# EAGLE design ESPRO_2 (EAGLE 6.3)
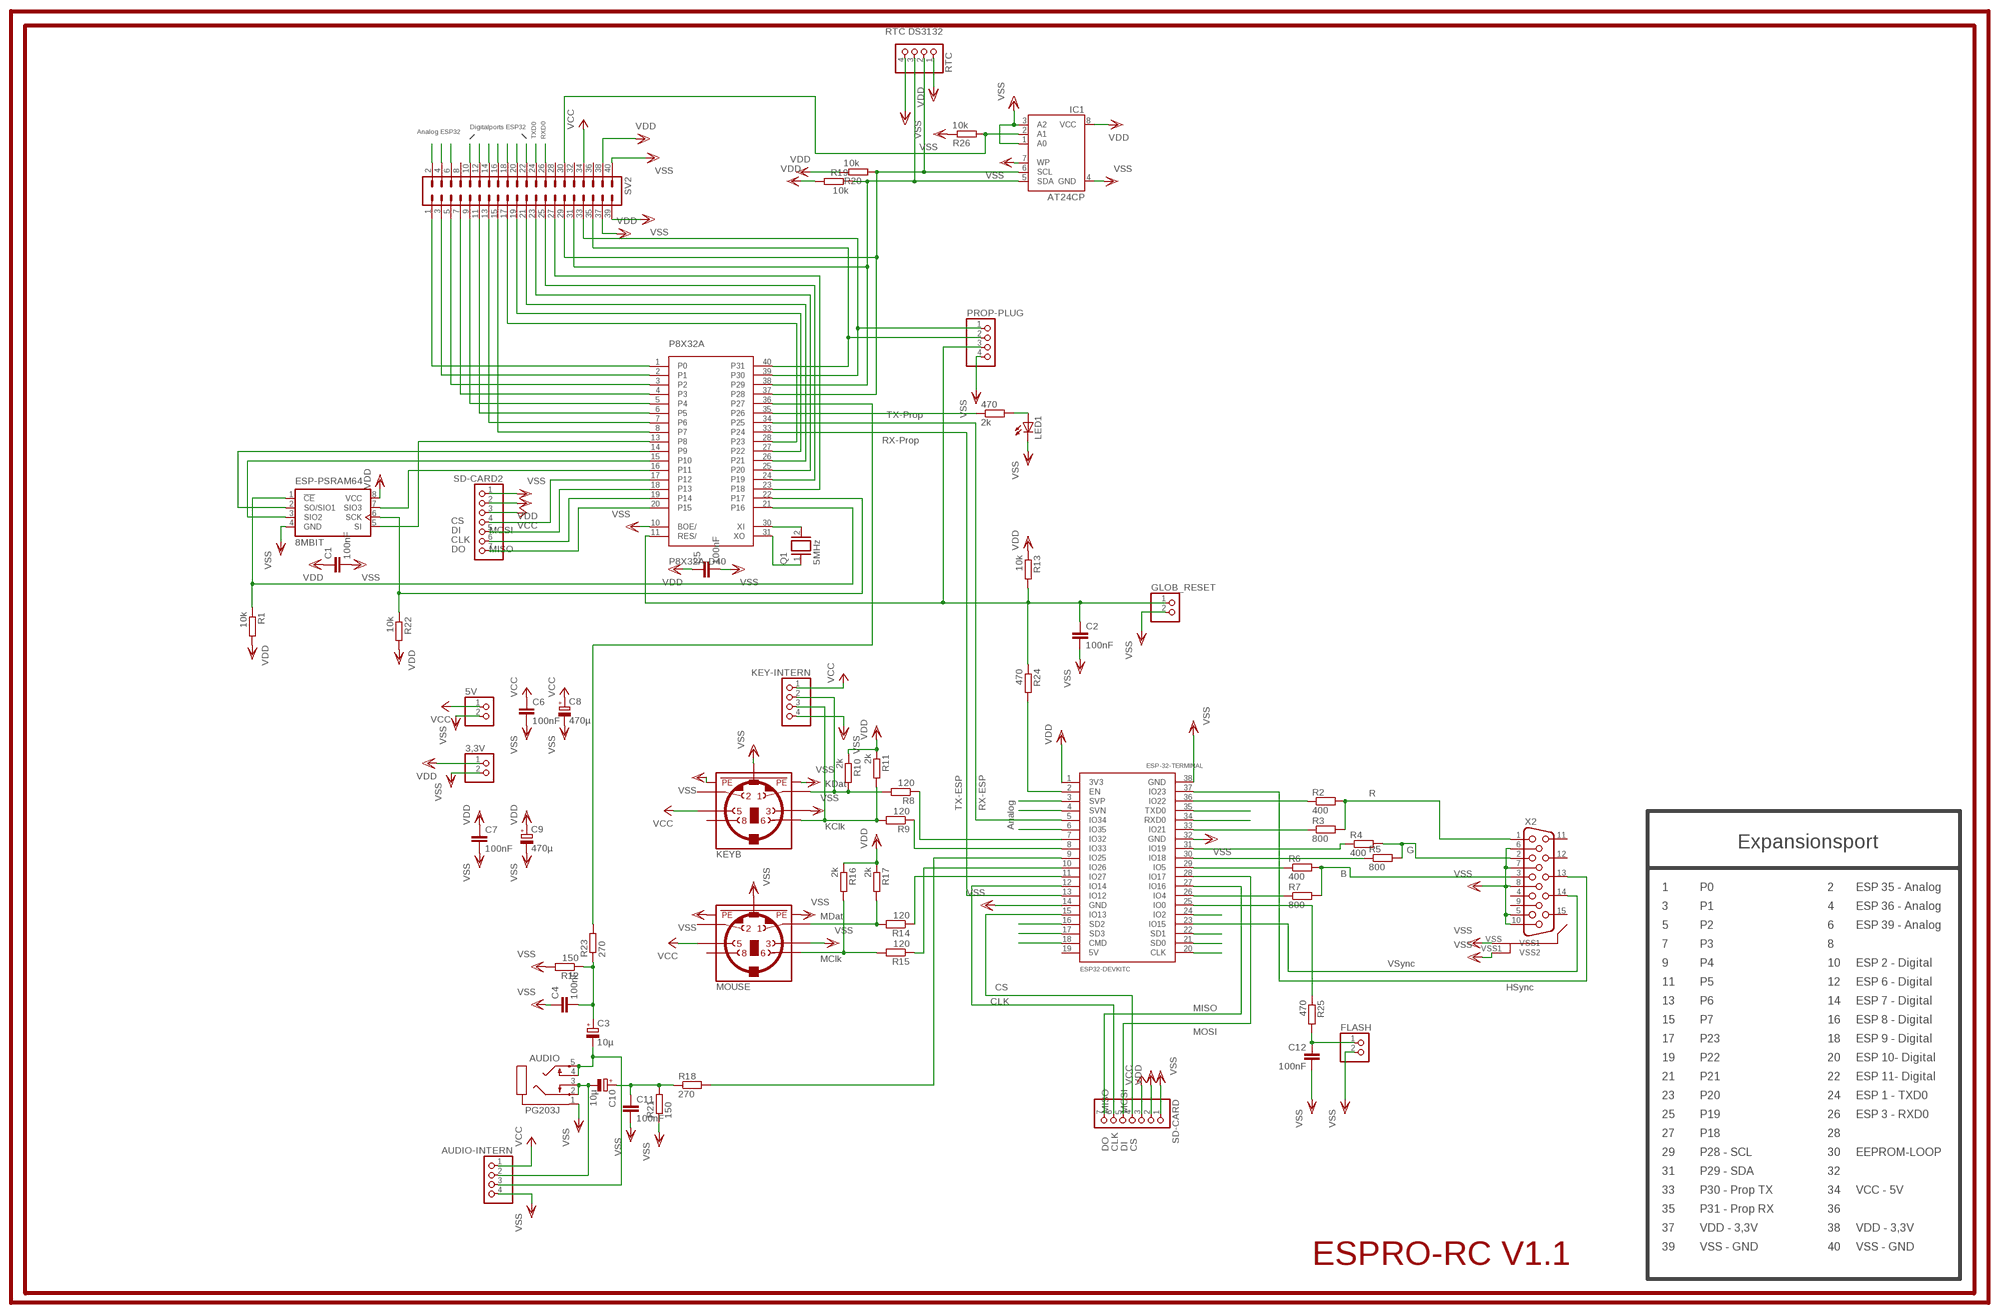
[diagram p0: schematic, sheet 1]

## Parts
3,3V  PINHD-1X2  [1X02]
5V  PINHD-1X2  [1X02]
470  2k  R-EU_0204/7  [0204/7]
AUDIO  PG203J  [PG203J]
AUDIO-INTERN  PINHD-1X4  [1X04]
C1  100nF  C-EU025-030X050  [C025-030X050]
C2  100nF  C-EU025-030X050  [C025-030X050]
C3  10µ  CPOL-EUE2-4  [E2-4]
C4  100nF  C-EU025-030X050  [C025-030X050]
C5  100nF  C-EU025-030X050  [C025-030X050]
C6  100nF  C-EU025-030X050  [C025-030X050]
C7  100nF  C-EU025-030X050  [C025-030X050]
C8  470µ  CPOL-EUE3.5-10  [E3,5-10]
C9  470µ  CPOL-EUE3.5-10  [E3,5-10]
C10  10µ  CPOL-EUE2-4  [E2-4]
C11  100nF  C-EU025-030X050  [C025-030X050]
C12  100nF  C-EU025-030X050  [C025-030X050]
ESP-32-TERMINAL  ESP32DEVKITC  [ESP32-DEVKITC]
ESP-PSRAM64  8MBIT  AT25P  [DIL08]
FLASH  PINHD-1X2  [1X02]
GLOB_RESET  PINHD-1X2  [1X02]
IC1  AT24CP  [DIL08]
KEY-INTERN  PINHD-1X4  [1X04]
KEYB  MINI_DIN_6  [M_DIN6]
LED1  LED5MM  [LED5MM]
MOUSE  MINI_DIN_6  [M_DIN6]
P8X32A  P8X32A-D40  [P8X32A-D40]
PROP-PLUG  PINHD-1X4  [1X04]
Q1  5MHz  XTAL/S  [QS]
R1  10k  R-EU_0204/7  [0204/7]
R2  400  R-EU_0204/7  [0204/7]
R3  800  R-EU_0204/7  [0204/7]
R4  400  R-EU_0204/7  [0204/7]
R5  800  R-EU_0204/7  [0204/7]
R6  400  R-EU_0204/7  [0204/7]
R7  800  R-EU_0204/7  [0204/7]
R8  120  R-EU_0204/7  [0204/7]
R9  120  R-EU_0204/7  [0204/7]
R10  2k  R-EU_0204/7  [0204/7]
R11  2k  R-EU_0204/7  [0204/7]
R12  150  R-EU_0204/7  [0204/7]
R13  10k  R-EU_0204/7  [0204/7]
R14  120  R-EU_0204/7  [0204/7]
R15  120  R-EU_0204/7  [0204/7]
R16  2k  R-EU_0204/7  [0204/7]
R17  2k  R-EU_0204/7  [0204/7]
R18  270  R-EU_0204/7  [0204/7]
R19  10k  R-EU_0204/7  [0204/7]
R20  10k  R-EU_0204/7  [0204/7]
R21  150  R-EU_0204/7  [0204/7]
R22  10k  R-EU_0204/7  [0204/7]
R23  270  R-EU_0204/7  [0204/7]
R24  470  R-EU_0204/7  [0204/7]
R25  470  R-EU_0204/7  [0204/7]
R26  10k  R-EU_0204/7  [0204/7]
RTC  PINHD-1X4  [1X04]
SD-CARD  PINHD-1X7  [1X07]
SD-CARD2  PINHD-1X7  [1X07]
SV2  ML40L  [ML40L]
X2  HF15H  [HDF15H]

## Nets
A35: ESP-32-TERMINAL.6(IO35) SV2.2
A36: ESP-32-TERMINAL.3(SVP) SV2.4
A39: ESP-32-TERMINAL.4(SVN) SV2.6
CLK: ESP-32-TERMINAL.12(IO14) SD-CARD.6
CS: ESP-32-TERMINAL.15(IO13) SD-CARD.4
E0: ESP-32-TERMINAL.25(IO0) R25.1
E2: ESP-32-TERMINAL.5(IO34) ESP-32-TERMINAL.24(IO2) P8X32A.34(P25) SV2.10
E6: ESP-32-TERMINAL.20(CLK) SV2.12
E7: ESP-32-TERMINAL.21(SD0) SV2.14
E8: ESP-32-TERMINAL.22(SD1) SV2.16
E9: ESP-32-TERMINAL.16(SD2) SV2.18
E10: ESP-32-TERMINAL.17(SD3) SV2.20
E11: ESP-32-TERMINAL.18(CMD) SV2.22
E12: ESP-32-TERMINAL.13(IO12) P8X32A.33(P24)
MISO: ESP-32-TERMINAL.27(IO16) SD-CARD.7
MOSI: ESP-32-TERMINAL.28(IO17) SD-CARD.5
N$1: ESP-PSRAM64.1(!CE!) P8X32A.21(P16) R1.1
N$2: ESP-PSRAM64.6(SCK) P8X32A.22(P17) R22.1
N$3: P8X32A.20(P15) SD-CARD2.7
N$4: P8X32A.19(P14) SD-CARD2.6
N$5: P8X32A.18(P13) SD-CARD2.5
N$6: P8X32A.17(P12) SD-CARD2.4
N$7: 470.1 P8X32A.35(P26)
N$8: ESP-32-TERMINAL.9(IO25) R18.2
N$9: ESP-PSRAM64.5(SI) P8X32A.13(P8)
N$10: ESP-PSRAM64.2(SO/SIO1) P8X32A.14(P9)
N$11: ESP-PSRAM64.3(SIO2) P8X32A.15(P10)
N$12: ESP-PSRAM64.7(SIO3) P8X32A.16(P11)
N$13: C10.+ C11.1 R18.1 R21.2
N$14: AUDIO-INTERN.2 AUDIO.2 AUDIO.3 C10.-
N$15: ESP-32-TERMINAL.2(EN) R24.2
N$16: C12.1 FLASH.1 R25.2
N$17: AUDIO-INTERN.3 AUDIO.4 AUDIO.5 C3.-
N$18: C3.+ C4.2 R12.1 R23.1
N$19: IC1.2(A1) R26.2 SV2.30
N$41: R6.2 R7.2 X2.3
N$42: R4.2 R5.2 X2.2
N$43: R2.2 R3.2 X2.1
N$44: ESP-32-TERMINAL.36(IO22) R2.1
N$45: ESP-32-TERMINAL.33(IO21) R3.1
N$46: ESP-32-TERMINAL.31(IO19) R4.1
N$47: ESP-32-TERMINAL.30(IO18) R5.1
N$48: ESP-32-TERMINAL.29(IO5) R6.1
N$49: ESP-32-TERMINAL.26(IO4) R7.1
N$50: ESP-32-TERMINAL.37(IO23) X2.13
N$51: ESP-32-TERMINAL.23(IO15) X2.14
N$60: 470.2 LED1.A
N$61: MOUSE.6 R15.2 R16.2
N$62: MOUSE.1 R14.2 R17.2
N$75: KEY-INTERN.2 KEYB.1 R8.2 R10.2
N$76: ESP-32-TERMINAL.7(IO32) R8.1
N$77: KEY-INTERN.3 KEYB.6 R9.2 R11.2
N$78: ESP-32-TERMINAL.8(IO33) R9.1
N$79: P8X32A.30(XI) Q1.2
N$82: ESP-32-TERMINAL.11(IO27) R14.1
N$83: ESP-32-TERMINAL.10(IO26) R15.1
N$93: P8X32A.31(XO) Q1.1
P0: P8X32A.1(P0) SV2.1
P1: P8X32A.2(P1) SV2.3
P2: P8X32A.3(P2) SV2.5
P3: P8X32A.4(P3) SV2.7
P4: P8X32A.5(P4) SV2.9
P5: P8X32A.6(P5) SV2.11
P6: P8X32A.7(P6) SV2.13
P7: P8X32A.8(P7) SV2.15
P18: P8X32A.23(P18) SV2.27
P19: P8X32A.24(P19) SV2.25
P20: P8X32A.25(P20) SV2.23
P21: P8X32A.26(P21) SV2.21
P22: P8X32A.27(P22) SV2.19
P23: P8X32A.28(P23) SV2.17
P27: P8X32A.36(P27) R23.2
P28: IC1.6(SCL) P8X32A.37(P28) R20.2 RTC.2 SV2.29
P29: IC1.5(SDA) P8X32A.38(P29) R19.1 RTC.3 SV2.31
P30: P8X32A.39(P30) PROP-PLUG.1 SV2.33
P31: P8X32A.40(P31) PROP-PLUG.2 SV2.35
RESET: C2.1 GLOB_RESET.1 P8X32A.11(RES/) PROP-PLUG.3 R13.2 R24.1
RXD0: ESP-32-TERMINAL.34(RXD0) SV2.26
TXD0: ESP-32-TERMINAL.35(TXD0) SV2.24
VCC [Power]: 5V.1 AUDIO-INTERN.1 C6.1 C8.+ KEY-INTERN.1 KEYB.5 MOUSE.5 SD-CARD2.3 SD-CARD.3 SV2.34
VDD [Power]: 3,3V.1 C1.1 C5.1 C7.1 C9.+ ESP-32-TERMINAL.1(3V3) ESP-PSRAM64.8(VCC) IC1.8(VCC) R1.2 R10.1 R11.1 R13.1 R16.1 R17.1 R19.2 R20.1 R22.2 RTC.1 SD-CARD2.2 SD-CARD.2 SV2.37 SV2.38
VSS [Power]: 3,3V.2 5V.2 AUDIO-INTERN.4 AUDIO.1 C1.2 C2.2 C4.1 C5.2 C6.2 C7.2 C8.- C9.- C11.2 C12.2 ESP-32-TERMINAL.14(GND) ESP-32-TERMINAL.32(GND) ESP-32-TERMINAL.38(GND) ESP-PSRAM64.4(GND) FLASH.2 GLOB_RESET.2 IC1.1(A0) IC1.3(A2) IC1.4(GND) IC1.7(WP) KEY-INTERN.4 KEYB.3 KEYB.SH1(PE1) KEYB.SH2(PE2) KEYB.SH3(PE3) LED1.K(C) MOUSE.3 MOUSE.SH1(PE1) MOUSE.SH2(PE2) MOUSE.SH3(PE3) P8X32A.10(BOE/) PROP-PLUG.4 R12.2 R21.1 R26.1 RTC.4 SD-CARD2.1 SD-CARD.1 SV2.39 SV2.40 X2.5 X2.6 X2.7 X2.8 X2.10 X2.VSS1(VSS2) X2.VSS(VSS1)
Unconnected: ESP-32-TERMINAL.19(5V) KEYB.2 KEYB.8 MOUSE.2 MOUSE.8 SV2.8 SV2.28 SV2.32 SV2.36 X2.4 X2.9 X2.11 X2.12 X2.15

## Notes on the sheet
- RTC DS3132
- Analog ESP32 | Digitalports ESP32
- TXD0 | RXD0
- TX-Prop
- RX-Prop
- CS
- DI | MOSI
- CLK
- DO | MISO
- KDat
- R
- TX-ESP | RX-ESP
- KClk | Analog
- Expansionsport
- G
- B
- 1 | P0 | 2 | ESP 35 - Analog
- 3 | P1 | 4 | ESP 36 - Analog
- MDat
- 5 | P2 | 6 | ESP 39 - Analog
- 7 | P3 | 8
- MClk
- VSync | 9 | P4 | 10 | ESP 2 - Digital
- 11 | P5 | 12 | ESP 6 - Digital
- CS | HSync
- CLK | MISO | 13 | P6 | 14 | ESP 7 - Digital
- 15 | P7 | 16 | ESP 8 - Digital
- MOSI
- 17 | P23 | 18 | ESP 9 - Digital
- 19 | P22 | 20 | ESP 10- Digital
- 21 | P21 | 22 | ESP 11- Digital
- 23 | P20 | 24 | ESP 1 - TXD0
- MISO | MOSI
- 25 | P19 | 26 | ESP 3 - RXD0
- 27 | P18 | 28
- DO | CLK | DI | CS
- 29 | P28 - SCL | 30 | EEPROM-LOOP
- 31 | P29 - SDA | 32
- 33 | P30 - Prop TX | 34 | VCC - 5V
- 35 | P31 - Prop RX | 36
- 37 | VDD - 3,3V | 38 | VDD - 3,3V
- 39 | VSS - GND | 40 | VSS - GND
- ESPRO-RC V1.1

## Power pins joined to a net without a drawn wire
GND: P8X32A.9(GND) P8X32A.29(GND)
VDD: P8X32A.12(VDD) P8X32A.32(VDD)

## Library data of the parts
3,3V 5V FLASH GLOB_RESET = pinhead:PINHD-1X2: PIN HEADER
470 R1-R26 = rcl:R-EU_: RESISTOR, European symbol
AUDIO = con-hirschmann:PG203J: MIC/HEADPHONE JACK KS-S stereo microphone/headphone jack PG203JN (Schukat); OC_FARNELL: unknown; OC_NEWARK: unknown
AUDIO-INTERN KEY-INTERN PROP-PLUG RTC = pinhead:PINHD-1X4: PIN HEADER
C1 C2 C4-C7 C11 C12 = rcl:C-EU: CAPACITOR, European symbol
C3 C8-C10 = rcl:CPOL-EU: POLARIZED CAPACITOR, European symbol
ESP-32-TERMINAL = ESP32-DEVKITC:ESP32DEVKITC
ESP-PSRAM64 = ESP-PSRAM:AT25*: EEPROM SPI bus serial
IC1 = atmel:AT24C*: 2-wire serial EEPROM; MPN: AT24C1024BW-SH-B; OC_FARNELL: 1362646; OC_NEWARK: 03P2044
KEYB MOUSE = mini_din:MINI_DIN_6
LED1 = led:LED: LED OSRAM: - CHIPLED LG R971, LG N971, LY N971, LG Q971, LY Q971, LO R971, LY R971 LH N974, LH R974 LS Q976, LO Q976, LY Q976 LO Q996 - Hyper CHIPLED LW Q18S LB Q993, LB Q99A, LB R99A - SideLED LS A670, LO A670, LY A670, LG A670, LP A670 LB A673, LV A673, LT A673, LW A673 LH A674 LY A675 LS A676, LA A676, LO A676, LY A676, LW A676 LS A679, LY A679, LG A679 - Hyper Micro SIDELED® LS Y876, LA Y876, LO Y876, LY Y876 LT Y87S - SmartLED LW L88C, LW L88S LB L89C, LB L89S, LG L890 LS L89K, LO L89K, LY L89K LS L896, LA L896, LO L896, LY L896 - TOPLED LS T670, LO T670, LY T670, LG T670, LP T670 LSG T670, LSP T670, LSY T670, LOP T670, LYG T670 LG T671, LOG T671, LSG T671 LB T673, LV T673, LT T673, LW T673 LH T674 LS T676, LA T676, LO T676, LY T676, LB T676, LH T676, LSB T676, LW T676 LB T67C, LV T67C, LT T67C, LS T67K, LO T67K, LY T67K, LW E67C LS E67B, LA E67B, LO E67B, LY E67B, LB E67C, LV E67C, LT E67C LW T67C LS T679, LY T679, LG T679 LS T770, LO T770, LY T770, LG T770, LP T770 LB T773, LV T773, LT T773, LW T773 LH T774 LS E675, LA E675, LY E675, LS T675 LS T776, LA T776, LO T776, LY T776, LB T776 LHGB T686 LT T68C, LB T68C - Hyper Mini TOPLED® LB M676 - Mini TOPLED Santana® LG M470 LS M47K, LO M47K, LY M47K Source: http://www.osram.convergy.de LUXEON: - LUMILED® LXK2-PW12-R00, LXK2-PW12-S00, LXK2-PW14-U00, LXK2-PW14-V00 LXK2-PM12-R00, LXK2-PM12-S00, LXK2-PM14-U00 LXK2-PE12-Q00, LXK2-PE12-R00, LXK2-PE12-S00, LXK2-PE14-T00, LXK2-PE14-U00 LXK2-PB12-K00, LXK2-PB12-L00, LXK2-PB12-M00, LXK2-PB14-N00, LXK2-PB14-P00, LXK2-PB14-Q00 LXK2-PR12-L00, LXK2-PR12-M00, LXK2-PR14-Q00, LXK2-PR14-R00 LXK2-PD12-Q00, LXK2-PD12-R00, LXK2-PD12-S00 LXK2-PH12-R00, LXK2-PH12-S00 LXK2-PL12-P00, LXK2-PL12-Q00, LXK2-PL12-R00 Source: www.luxeon.com KINGBRIGHT: KA-3528ASYC Source: www.kingbright.com
P8X32A = parallax_propeller:P8X32A-D40
Q1 = special:XTAL/S: CRYSTAL
SD-CARD SD-CARD2 = pinhead:PINHD-1X7: PIN HEADER
SV2 = con-ml:ML40L: HARTING; OC_FARNELL: unknown; OC_NEWARK: unknown
X2 = con-subd:HF15: SUB-D; OC_FARNELL: unknown; OC_NEWARK: unknown

## Net classes
0 default: width 0.254 mm, clearance 0.254 mm
1 Power: width 0.635 mm, drill 0.61 mm, clearance 0.381 mm

## Board
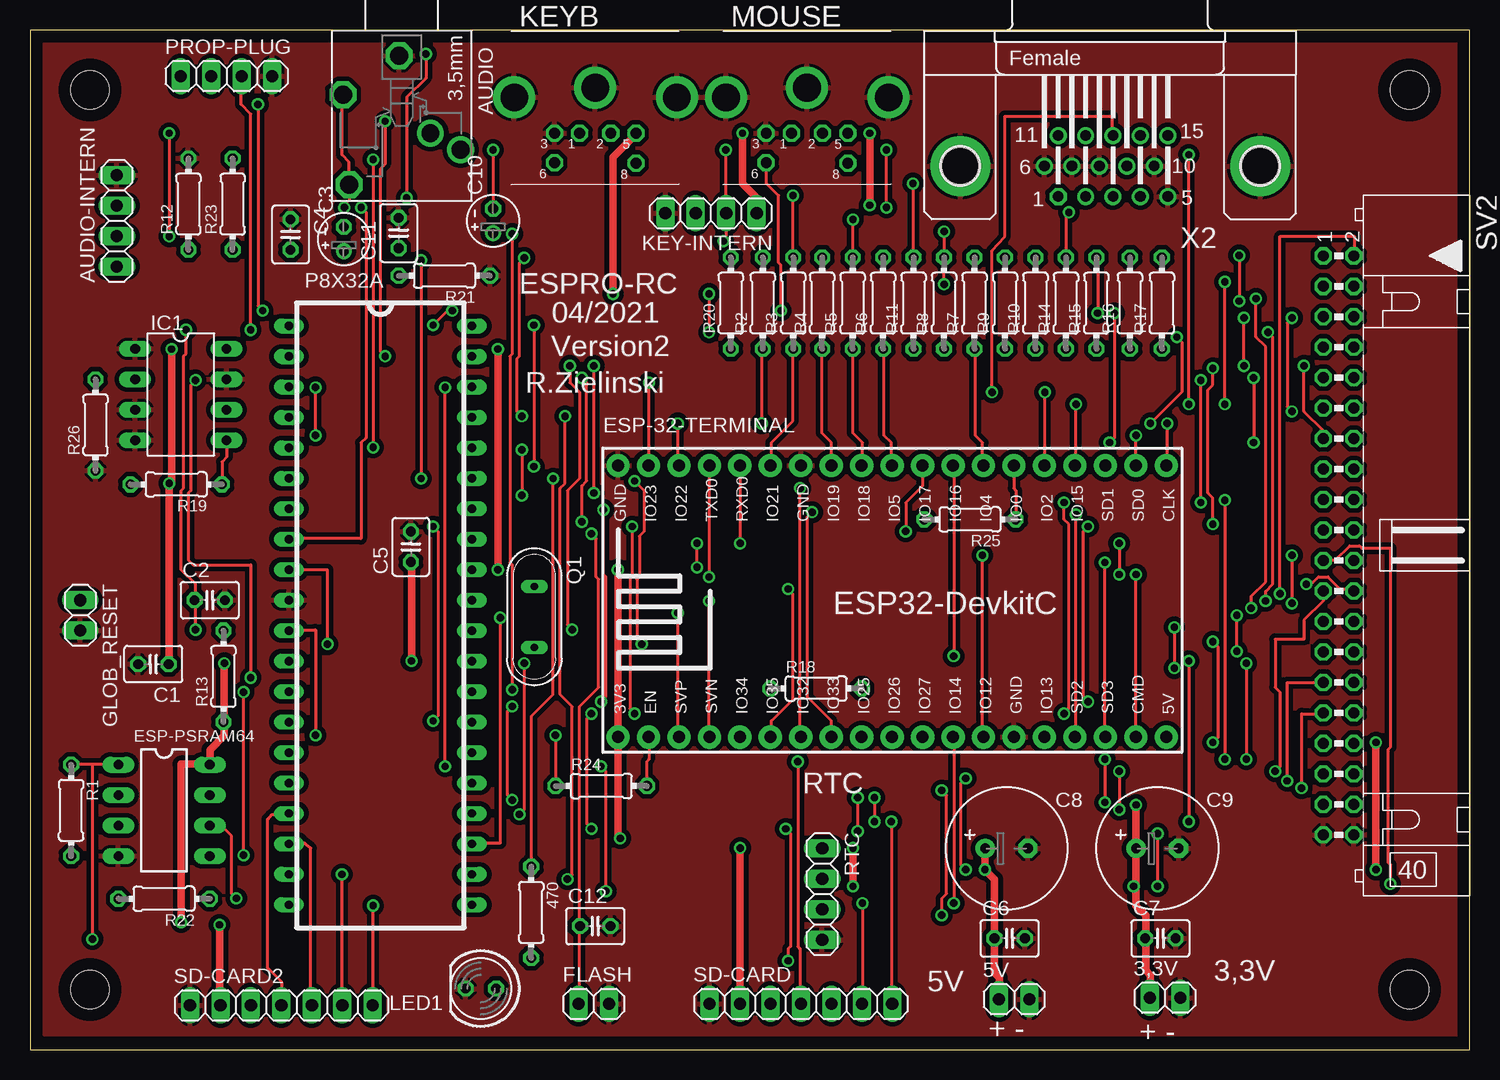
[diagram p1: board, top side]
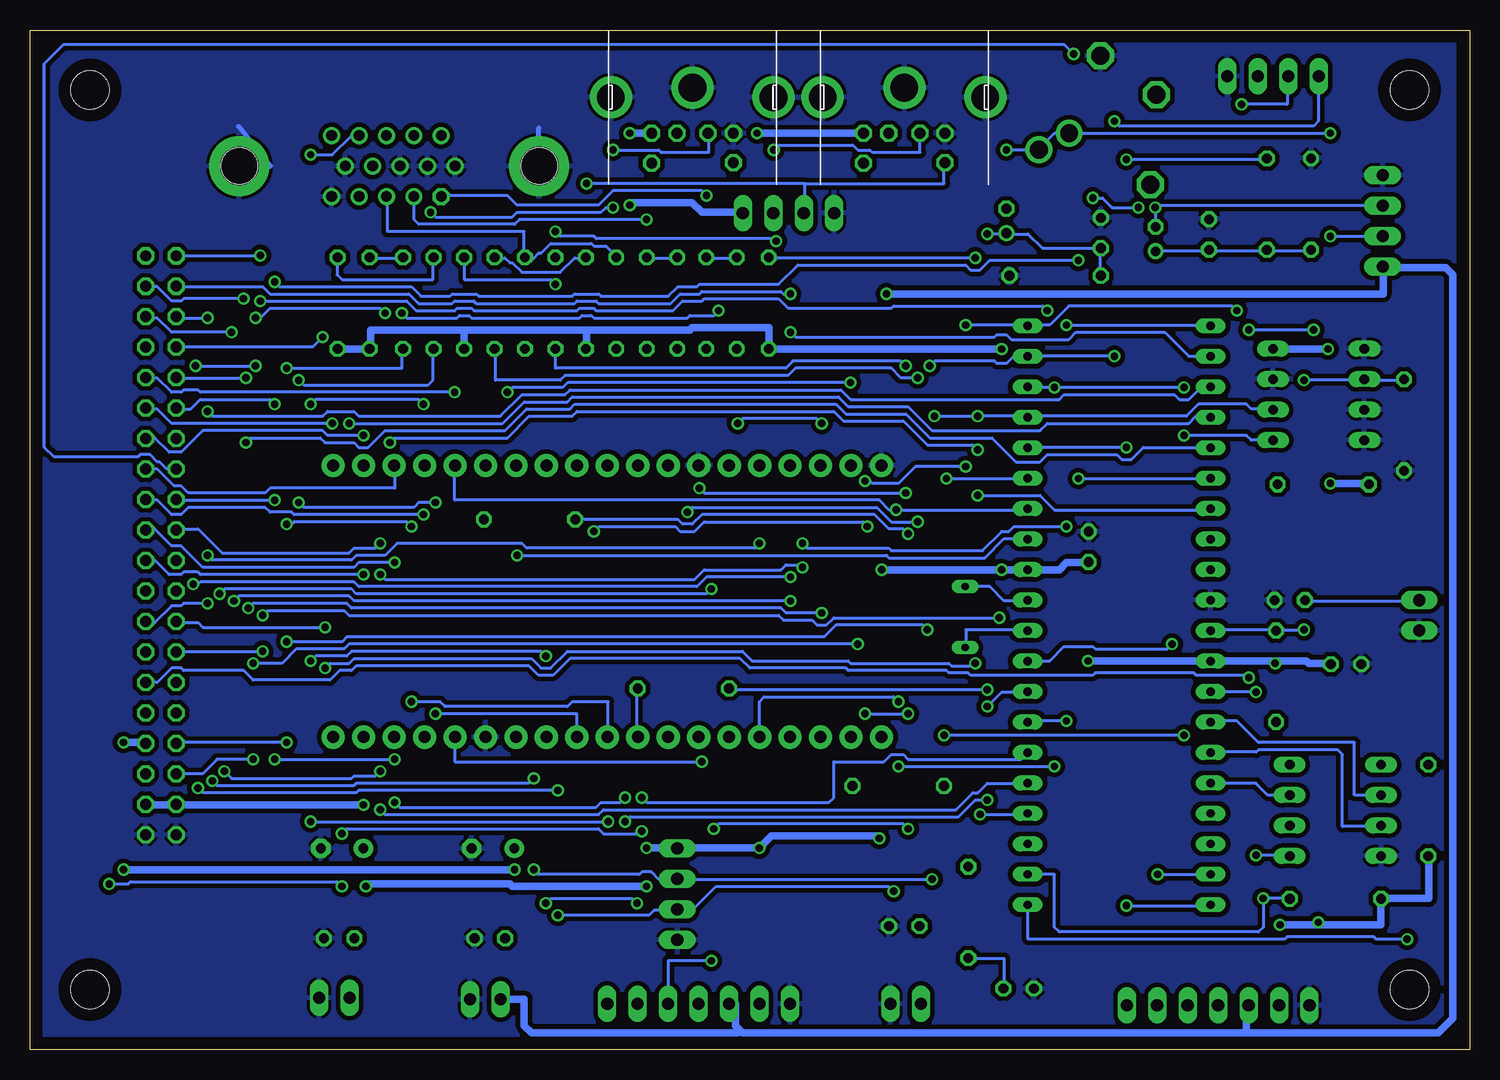
[diagram p2: board, bottom side, seen from below]

Size 120 x 85 mm. Coordinates in mm from the lower left corner, seen from the top.
Outline: 0,0 120,0 120,85 0,85 0,0
Copper layers (1*16): Top 0.035mm / dielectric 1.5mm / Bottom 0.035mm
Design rules "default": minimum track width 10mil, minimum drill 24mil, track to track 8mil, track to pad 8mil, pad to pad 8mil, via to via 8mil, smd to smd 8mil, copper to edge 40mil, drill to drill 8mil, minimum pad ring 10mil, minimum via ring 8mil, stop-mask expansion 4mil, vias tented up to drill 0mil, thermal gap 10mil
Holes 3.2 mm at 5,80 115,80 115,5 5,5

### Footprints (pad centres in the part's own frame; a part is rotated, then mirrored left to right if it is on the bottom)
1X02 = drill 1.016 long: 1 -1.27,0; 2 1.27,0
0204/7 = drill 0.813 octagon: 1 -3.81,0; 2 3.81,0
PG203J = drill 1.499 octagon: 1 -5.004,-0.203; 4 5.74,-4.369; 5 -1.753,-4.902 | drill 1.499: 2 2.845,4.902; 3 1.448,2.388
1X04 = drill 1.016 long: 1 -3.81,0; 2 -1.27,0; 3 1.27,0; 4 3.81,0
C025-030X050 = drill 0.813 octagon: 1 -1.27,0; 2 1.27,0
E2-4 = drill 0.813 pad 1.27: + -1.016,0 | drill 0.813 pad 1.27 octagon: - 1.016,0
E3,5-10 = drill 0.813 pad 1.6: + -1.778,0 | drill 0.813 pad 1.6 octagon: - 1.778,0
ESP32-DEVKITC = drill 1 pad 1.93: 1 -22.87,-11.42; 2 -20.33,-11.42; 3 -17.79,-11.42; 4 -15.25,-11.42; 5 -12.71,-11.42; 6 -10.17,-11.42; 7 -7.63,-11.42; 8 -5.09,-11.42; 9 -2.55,-11.42; 10 -0.01,-11.42; 11 2.53,-11.42; 12 5.07,-11.42; 13 7.61,-11.42; 14 10.15,-11.42; 15 12.69,-11.42; 16 15.23,-11.42; 17 17.77,-11.42; 18 20.31,-11.42; 19 22.85,-11.42; 20 22.85,11.23; 21 20.31,11.23; 22 17.77,11.23; 23 15.23,11.23; 24 12.69,11.23; 25 10.15,11.23; 26 7.61,11.23; 27 5.07,11.23; 28 2.53,11.23; 29 -0.01,11.23; 30 -2.55,11.23; 31 -5.09,11.23; 32 -7.63,11.23; 33 -10.17,11.23; 34 -12.71,11.23; 35 -15.25,11.23; 36 -17.79,11.23; 37 -20.33,11.23; 38 -22.87,11.23
DIL08 = drill 0.813 long: 1 -3.81,-3.81; 2 -1.27,-3.81; 3 1.27,-3.81; 4 3.81,-3.81; 5 3.81,3.81; 6 1.27,3.81; 7 -1.27,3.81; 8 -3.81,3.81
M_DIN6 = drill 0.9 pad 1.422 octagon: 1 -1.3,-3.75; 2 1.3,-3.75; 3 -3.4,-3.75; 5 3.4,-3.75; 6 -3.4,-6.2; 8 3.4,-6.25 | drill 2.3 pad 3.5: SH1 6.8,-0.75; SH2 0,0.05; SH3 -6.75,-0.75
LED5MM = drill 0.813 octagon: A -1.27,0; K 1.27,0
P8X32A-D40 = drill 0.7 pad 1.27 long: 1 -7.62,23.495; 2 -7.62,20.955; 3 -7.62,18.415; 4 -7.62,15.875; 5 -7.62,13.335; 6 -7.62,10.795; 7 -7.62,8.255; 8 -7.62,5.715; 9 -7.62,3.175; 10 -7.62,0.635; 11 -7.62,-1.905; 12 -7.62,-4.445; 13 -7.62,-6.985; 14 -7.62,-9.525; 15 -7.62,-12.065; 16 -7.62,-14.605; 17 -7.62,-17.145; 18 -7.62,-19.685; 19 -7.62,-22.225; 20 -7.62,-24.765; 21 7.62,-24.765; 22 7.62,-22.225; 23 7.62,-19.685; 24 7.62,-17.145; 25 7.62,-14.605; 26 7.62,-12.065; 27 7.62,-9.525; 28 7.62,-6.985; 29 7.62,-4.445; 30 7.62,-1.905; 31 7.62,0.635; 32 7.62,3.175; 33 7.62,5.715; 34 7.62,8.255; 35 7.62,10.795; 36 7.62,13.335; 37 7.62,15.875; 38 7.62,18.415; 39 7.62,20.955; 40 7.62,23.495
QS = drill 0.61 long: 1 -2.54,0; 2 2.54,0
1X07 = drill 1.016 long: 1 -7.62,0; 2 -5.08,0; 3 -2.54,0; 4 0,0; 5 2.54,0; 6 5.08,0; 7 7.62,0
ML40L = drill 0.914 octagon: 1 -24.13,-1.27; 2 -24.13,1.27; 3 -21.59,-1.27; 4 -21.59,1.27; 5 -19.05,-1.27; 6 -19.05,1.27; 7 -16.51,-1.27; 8 -16.51,1.27; 9 -13.97,-1.27; 10 -13.97,1.27; 11 -11.43,-1.27; 12 -11.43,1.27; 13 -8.89,-1.27; 14 -8.89,1.27; 15 -6.35,-1.27; 16 -6.35,1.27; 17 -3.81,-1.27; 18 -3.81,1.27; 19 -1.27,-1.27; 20 -1.27,1.27; 21 1.27,-1.27; 22 1.27,1.27; 23 3.81,-1.27; 24 3.81,1.27; 25 6.35,-1.27; 26 6.35,1.27; 27 8.89,-1.27; 28 8.89,1.27; 29 11.43,-1.27; 30 11.43,1.27; 31 13.97,-1.27; 32 13.97,1.27; 33 16.51,-1.27; 34 16.51,1.27; 35 19.05,-1.27; 36 19.05,1.27; 37 21.59,-1.27; 38 21.59,1.27; 39 24.13,-1.27; 40 24.13,1.27
HDF15H = drill 0.9 octagon: 1 4.329,2.54 | drill 0.9: 2 2.043,2.54; 3 -0.243,2.54; 4 -2.529,2.54; 5 -4.815,2.54; 6 5.472,0; 7 3.186,0; 8 0.9,0; 9 -1.386,0; 10 -3.672,0; 11 4.329,-2.54; 12 2.043,-2.54; 13 -0.243,-2.54; 14 -2.529,-2.54; 15 -4.815,-2.54 | drill 3.2 pad 5: VSS -12.5,0; VSS1 12.5,0 | hole 3: -12.5,0; 12.5,0

### Placement (x,y rotation side)
3,3V  94.61,4.32 0 top
5V  82.04,4.19 0 top
470  41.78,11.43 270 top
AUDIO  30.99,77.85 270 top
AUDIO-INTERN  7.24,69.09 90 top
C1  10.29,32.13 180 top
C2  14.99,37.47 0 top
C3  26.16,67.56 90 top
C4  21.72,67.94 270 top
C5  31.75,41.91 90 top
C6  81.66,9.27 0 top
C7  94.23,9.27 0 top
C8  81.41,16.76 0 top
C9  93.98,16.76 0 top
C10  38.61,69.09 90 top
C11  30.73,68.07 90 top
C12  47.12,10.29 0 top
ESP-32-TERMINAL  71.88,37.47 0 top
ESP-PSRAM64  11.18,19.94 270 top
FLASH  46.99,3.81 0 top
GLOB_RESET  4.19,36.2 270 top
IC1  12.57,54.61 270 top
KEY-INTERN  56.77,69.72 180 top
KEYB  47.12,80.14 0 top
LED1  37.59,5.08 180 top
MOUSE  64.77,80.14 0 top
P8X32A  29.21,36.83 0 top
PROP-PLUG  16.38,81.15 0 top
Q1  42.04,36.07 270 top
R1  3.43,19.94 270 top
R2  61.09,62.23 90 top
R3  63.63,62.23 90 top
R4  66.04,62.23 90 top
R5  68.58,62.23 90 top
R6  71.12,62.23 90 top
R7  78.74,62.23 90 top
R8  76.2,62.23 90 top
R9  81.28,62.23 90 top
R10  83.82,62.23 90 top
R11  73.66,62.23 90 top
R12  13.21,70.48 90 top
R13  16.13,31.11 90 top
R14  86.36,62.23 90 top
R15  88.9,62.23 90 top
R16  91.69,62.23 90 top
R17  94.36,62.23 90 top
R18  65.53,30.1 0 top
R19  12.19,47.12 180 top
R20  58.42,62.23 90 top
R21  34.54,64.52 180 top
R22  11.18,12.57 180 top
R23  16.89,70.48 90 top
R24  47.62,21.97 0 top
R25  78.36,44.2 180 top
R26  5.46,52.07 90 top
RTC  66.04,12.95 270 top
SD-CARD  64.26,3.81 0 top
SD-CARD2  20.95,3.68 0 top
SV2  109.09,42.04 270 top
X2  90.04,73.66 180 top

### Tracks (layer width: path | path; a pad name or v marks a point on that pad's centre or on a via)
A35  (via drill 0.61)
  Top 0.254: v104.2,38 104.2,67.8 110.4,67.8 110.4,66.2 SV2.2 | v63.2,38.4 63.6,38 63.6,29.2 61.8,27.4 61.8,26.2 ESP-32-TERMINAL.6
  Bottom 0.254: v104.2,38 103.8,38.4 93.2,38.4 92.8,38 63.6,38 v63.2,38.4
A36  (via drill 0.61)
  Top 0.254: v102.2,62.6 102.2,59.4 103,58.6 103,39 101.8,37.8 v101.8,36.8 | v54,36.4 54,26.2 ESP-32-TERMINAL.3
  Bottom 0.254: v102.2,62.6 107.2,62.6 107.4,62.4 108.2,62.4 109.4,63.6 110.2,63.6 SV2.4 | v101.8,36.8 101.4,37.2 93.6,37.2 93.2,36.8 57.4,36.8 57,36.4 v54,36.4
A39  (via drill 0.61)
  Top 0.254: v103.2,59.8 103.6,59.4 103.6,38.8 103,38.2 v103,37.4 | v56.6,37.4 56.6,26.2 ESP-32-TERMINAL.4
  Bottom 0.254: v103.2,59.8 108.2,59.8 109.4,61 110.2,61 SV2.6 | v103,37.4 102.6,37.8 93.4,37.8 93,37.4 v56.6,37.4
CLK  (via drill 0.61)
  Top 0.254: v69.4,12.2 69.4,4 SD-CARD.6 | v77,12.2 77,26 ESP-32-TERMINAL.12
  Bottom 0.254: v69.4,12.2 69.8,12.6 76.6,12.6 v77,12.2
CS  (via drill 0.61)
  Top 0.254: v64,24 64,8.6 64.2,8.4 64.2,4 SD-CARD.4
  Bottom 0.254: v64,24 84.6,24 84.6,26 ESP-32-TERMINAL.15
E0
  Top 0.254: R25.1 82.2,44.2 82.2,46.6 82,46.8 82,48.6 ESP-32-TERMINAL.25
E2  (via drill 0.61)
  Top 0.254: v84.6,54.8 84.6,48.8 ESP-32-TERMINAL.24 | v47.8,45 47.8,39.6 48,39.4 48,29.4 v47.6,29
  Bottom 0.254: v84.6,54.8 105.8,54.8 106,55 107.2,55 107.4,54.8 108.2,54.8 109.4,56 110.2,56 SV2.10 | v47.6,29 48,29.4 58.8,29.4 59.2,29 59.2,26.2 ESP-32-TERMINAL.5 | P8X32A.34 37,45 v47.8,45 48.4,45 49.2,45.8 84.6,45.8 84.6,48.6 ESP-32-TERMINAL.24
E6  (via drill 0.61)
  Top 0.254: v94.8,52.2 94.8,48.8 ESP-32-TERMINAL.20
  Bottom 0.254: v94.8,52.2 108.2,52.2 109.4,53.4 110.2,53.4 SV2.12
E7  (via drill 0.61)
  Top 0.254: v92.2,51.2 92.2,48.8 ESP-32-TERMINAL.21
  Bottom 0.254: v92.2,51.2 95.2,51.2 95.6,51.6 105.6,51.6 107.4,49.8 108.4,49.8 109.6,51 110.2,51 SV2.14
E8
  Bottom 0.254: SV2.16 110.2,48.4 109.4,48.4 108,47 107.4,47 106.8,46.4 100.4,46.4 100,46.8 89.6,46.8 89.6,48.6 ESP-32-TERMINAL.22
E9  (via drill 0.61)
  Top 0.254: v87.2,44.6 87.2,26.2 ESP-32-TERMINAL.16
  Bottom 0.254: v87.2,44.6 98,44.6 98.2,44.8 100,44.8 100.4,45.2 106.8,45.2 107.4,44.6 108.2,44.6 109.4,45.8 110.2,45.8 SV2.18
E10  (via drill 0.61)
  Top 0.254: v89.6,40.6 89.6,26.2 ESP-32-TERMINAL.17
  Bottom 0.254: v89.6,40.6 92.6,40.6 93,40.2 105.6,40.2 107.4,42 108.2,42 109.6,43.4 110.2,43.4 SV2.20
E11  (via drill 0.61)
  Top 0.254: v92.2,39.6 92.2,26.2 ESP-32-TERMINAL.18
  Bottom 0.254: v92.2,39.6 105.8,39.6 106,39.8 107.2,39.8 107.4,39.6 108.4,39.6 109.6,40.8 110.2,40.8 SV2.22
E12  (via drill 0.61)
  Top 0.254: v79.4,41.2 79.4,26.2 ESP-32-TERMINAL.13
  Bottom 0.254: v79.4,41.2 48.6,41.2 48.4,41 40.4,41 38.8,42.6 37,42.6 P8X32A.33
GND  (via drill 0.61)
  Top 0.254: v24.8,33.8 24.8,40 P8X32A.9
  Bottom 0.254: v24.8,33.8 25.2,33.4 31.2,33.4 31.4,33.6 33.8,33.6 35,32.4 36.8,32.4 P8X32A.29
MISO  (via drill 0.61)
  Top 0.254: v71.8,19 71.8,4 SD-CARD.7 | v96.6,32.4 v96.6,19 | v77,32.8 77,48.6 ESP-32-TERMINAL.27
  Bottom 0.254: v96.6,19 v71.8,19 | v96.6,32.4 96.2,32.8 93.6,32.8 93.2,33.2 77.4,33.2 v77,32.8
MOSI  (via drill 0.61)
  Top 0.254: v63.2,7.4 63.2,8.4 63.4,8.6 63.4,18 v63,18.4 | v46.8,18.4 46.4,18.8 46.4,27.6 v46.8,28 | v50.4,28 50,28.4 50,39.4 50.2,39.6 v50.2,43.6 | v73,43.2 73,45.6 74.4,47 74.4,48.6 ESP-32-TERMINAL.28
  Bottom 0.254: v63.2,7.4 66.8,7.4 66.8,4 SD-CARD.5 | v63,18.4 62.6,18.8 47.2,18.8 v46.8,18.4 | v50.4,28 v46.8,28 | v50.2,43.6 50.6,44 63.8,44 64.6,43.2 65.8,43.2 66.2,43.6 72.6,43.6 v73,43.2
N$1  (via drill 0.61)
  Top 0.254: 5.2,23.8 v5.2,9.2 | 5.2,23.8 3.6,23.8 R1.1 | 5.2,23.8 7.2,23.8 ESP-PSRAM64.1
  Bottom 0.254: v5.2,9.2 7.8,9.2 8,9.4 15.2,9.4 15.4,9.2 36.8,9.2 36.8,12 P8X32A.21
N$2  (via drill 0.61)
  Top 0.254: v17.2,12.6 16.8,13 16.8,17.8 16,18.6 15,18.6 ESP-PSRAM64.6
  Bottom 0.254: P8X32A.22 36.8,14.6 34.6,14.6 34.6,10.2 34.2,9.8 17.6,9.8 17.2,10.2 v17.2,12.6 15,12.6 R22.1
N$3  (via drill 0.61)
  Top 0.254: v28.6,12 28.6,3.8 SD-CARD2.7
  Bottom 0.254: v28.6,12 21.6,12 P8X32A.20
N$4  (via drill 0.61)
  Top 0.254: v26,14.6 26,3.8 SD-CARD2.6
  Bottom 0.254: v26,14.6 P8X32A.19
N$5
  Top 0.254: P8X32A.18 21.6,17.2 22.91,17.2 23.4,16.8 23.4,3.8 SD-CARD2.5
N$6
  Top 0.254: P8X32A.17 21.4,19.6 20.16,19.6 19.8,19.2 19.8,6.8 21,5.6 21,3.8 SD-CARD2.4
N$7  (via drill 0.61)
  Top 0.254: v43.6,47.6 43.6,29.6 41.8,27.8 41.8,15.4 470.1
  Bottom 0.254: v43.6,47.6 37,47.6 P8X32A.35
N$8
  Bottom 0.254: R18.2 69.4,30 69.4,26.2 ESP-32-TERMINAL.9
N$9  (via drill 0.61)
  Top 0.254: v17.8,16.2 v17.8,29.8
  Bottom 0.254: v17.8,29.8 21.4,29.8 P8X32A.13 | v17.8,16.2 15,16.2 ESP-PSRAM64.5
N$10
  Bottom 0.254: P8X32A.14 21.4,27.4 19.4,27.4 17.6,25.6 9.6,25.6 9.6,21.2 7.4,21.2 ESP-PSRAM64.2
N$11
  Bottom 0.254: P8X32A.15 21.4,24.8 17.8,24.8 17.6,25 11,25 10.6,24.6 10.6,18.6 7.4,18.6 ESP-PSRAM64.3
N$12
  Bottom 0.254: P8X32A.16 21.4,22.2 17.8,22.2 16.8,21.2 ESP-PSRAM64.7
N$13  (via drill 0.61)
  Top 0.254: v40.2,30 40.2,40.4 40,40.6 40,57.8 40.2,58 v40.2,68
  Bottom 0.254: 30.8,66.8 30.8,64.6 R21.2 | v40.2,30 61.6,30 R18.1 | v40.2,68 38.8,68 C10.+ 38.6,68 36.8,68 35.6,66.8 30.8,66.8 | 30.8,66.8 C11.1
N$14  (via drill 0.61)
  Top 0.254: v38.6,75 38.6,70.2 C10.- | v11.6,76.4 v11.6,67.8
  Bottom 0.254: v38.6,75 36,75 AUDIO.2 35.8,75.2 34.6,76.4 33.4,76.4 AUDIO.3 33.2,76.4 v11.6,76.4 | v11.6,67.8 7.4,67.8 AUDIO-INTERN.2
N$15
  Top 0.254: R24.2 51.4,22 51.4,24 51.6,24.2 51.6,26 ESP-32-TERMINAL.2
N$16  (via drill 0.61)
  Top 0.254: FLASH.1 45.8,4 45.8,10.2 C12.1 45.8,10.4 45.8,28.6 47.4,30.2 47.4,39.2 47.2,39.4 47.2,42.6 v46.8,43
  Bottom 0.254: v46.8,43 47.2,43.4 48.4,43.4 49.6,44.6 64,44.6 64.8,43.8 65.6,43.8 66,44.2 74.4,44.2 R25.2
N$17  (via drill 0.61)
  Top 0.254: v26.2,70.2 26.2,70.4 26.6,70.8 26.6,72 AUDIO.4 26.6,72.2 26.6,74 26,74.6 26,79.6 AUDIO.5
  Bottom 0.254: C3.- 26.2,68.6 v26.2,70.2 26,70.4 7.4,70.4 AUDIO-INTERN.3
N$18
  Bottom 0.254: R12.1 13.4,66.6 16.8,66.6 R23.1 17,66.6 21.6,66.6 C4.2 21.8,66.6 26,66.6 C3.+
N$19  (via drill 0.61)
  Top 0.254: v18.4,31 18.4,40.4 13.6,40.4 13.2,40.8 13.2,46.4 13.4,46.6 13.4,55.4 v13.8,55.8
  Bottom 0.254: R26.2 5.6,55.8 8.6,55.8 IC1.2 8.8,55.8 v13.8,55.8 | v18.4,31 18.6,31.2 22.8,31.2 23,31.4 31.2,31.4 31.4,31.2 41.6,31.2 41.8,31.4 43.4,31.4 43.6,31.6 51.8,31.6 52,31.8 60,31.8 60.8,32.6 75,32.6 76.4,31.2 77.6,31.2 78.4,32 92.8,32 93.2,31.6 94.2,31.6 95,30.8 101.4,30.8 102.2,31.6 107.2,31.6 107.4,31.8 108.2,31.8 109.4,30.6 110.2,30.6 SV2.30
N$41
  Bottom 0.254: R6.2 71.2,66.2 72,67 73,67 73.2,67.2 76.6,67.2 77.4,66.4 77.6,66.4 78,66 78.6,66 R7.2 78.8,66.2 78.8,68.2 90.2,68.2 90.2,71 X2.3
N$42  (via drill 0.61)
  Top 0.254: v68.6,69.2 68.6,66.2 R5.2
  Bottom 0.254: R4.2 66.2,66 68.4,66 R5.2 | X2.2 88,69.2 87.6,68.8 79.6,68.8 79.2,69.2 v68.6,69.2
N$43  (via drill 0.61)
  Top 0.254: v63.6,71.2 63.6,66.2 R3.2
  Bottom 0.254: R2.2 61.2,66 63.6,66 R3.2 | v63.6,71.2 64,71.6 71.4,71.6 72.6,70.4 79.4,70.4 80.2,71.2 85.6,71.2 X2.1
N$44  (via drill 0.61)
  Top 0.254: v61,52.2 61,58.4 R2.1 | v54,52.2 54,48.8 ESP-32-TERMINAL.36
  Bottom 0.254: v61,52.2 60.6,52.6 54.4,52.6 v54,52.2
N$45
  Top 0.254: R3.1 63.6,58.4 63.6,52.4 61.8,50.6 61.8,48.8 ESP-32-TERMINAL.33
N$46
  Top 0.254: R4.1 66,58.4 66,51.4 66.8,50.6 66.8,48.8 ESP-32-TERMINAL.31
N$47
  Top 0.254: R5.1 68.6,58.4 68.6,51.4 69.4,50.6 69.4,48.8 ESP-32-TERMINAL.30
N$48
  Top 0.254: R6.1 71.2,58.4 71.2,51.2 71.8,50.6 71.8,48.8 ESP-32-TERMINAL.29
N$49
  Top 0.254: R7.1 78.8,58.4 78.8,51.2 79.4,50.6 79.4,48.8 ESP-32-TERMINAL.26
N$50  (via drill 0.61)
  Top 0.254: v80.2,54.8 80.2,66.6 81.25,67.78 81.25,77.8 90.2,77.8 90.2,76.2 X2.13 | v51.6,55.6 51.6,48.8 ESP-32-TERMINAL.37
  Bottom 0.254: v80.2,54.8 79.8,55.2 75.6,55.2 75.2,55.6 v51.6,55.6
N$51  (via drill 0.61)
  Top 0.254: v96.6,53.8 v96.6,74.6 | v87.2,53.8 87.2,48.8 ESP-32-TERMINAL.23
  Bottom 0.254: X2.14 93.2,76.2 94.8,74.6 v96.6,74.6 | v96.6,53.8 96.2,54.2 87.6,54.2 v87.2,53.8
N$60
  Bottom 0.254: LED1.A 38.8,5.2 38.8,7.6 41.6,7.6 470.2
N$61  (via drill 0.61)
  Top 0.254: v62.6,61.6 62.6,65.4 62.4,65.6 62.4,71.2 61.4,72.2 61.4,73.8 MOUSE.6 | v89,61.4 89,66 R15.2
  Bottom 0.254: R15.2 89,66 91.6,66 R16.2 | v62.6,61.6 63,61.2 65,61.2 65.2,61 73,61 73.2,61.2 74,61.2 74.2,61 83.2,61 83.4,61.2 84.2,61.2 84.4,61 88.6,61 v89,61.4
N$62  (via drill 0.61)
  Top 0.254: v71.4,70.2 v71.4,75 | v86.6,69.8 86.4,69.6 86.4,66.2 R14.2
  Bottom 0.254: R14.2 86.4,66 86.4,64.2 94,64.2 94.4,64.6 94.4,66 R17.2 | v71.4,75 67.6,75 67.4,74.8 63.4,74.8 63.4,76.2 MOUSE.1 | v71.4,70.2 72,70.2 72.4,69.8 79.4,69.8 79.8,69.4 86.2,69.4 v86.6,69.8
N$75  (via drill 0.61)
  Top 0.254: v76.2,63.8 R8.2 v76.2,68.2 | v58,75 58,69.8 KEY-INTERN.2 58,69.6 58,67.6 v57.8,67.4
  Bottom 0.254: v76.2,63.8 76.6,64.2 83.8,64.2 83.8,66 R10.2 | v58,75 57.6,75.4 51.4,75.4 51,75 50,75 49.8,74.8 45.8,74.8 45.8,76.2 KEYB.1 | v76.2,68.2 75.8,67.8 73,67.8 72.8,67.6 58,67.6 v57.8,67.4
N$76  (via drill 0.61)
  Top 0.254: v47,46.4 v47,57 | v64.2,46.8 64.2,26.2 ESP-32-TERMINAL.7
  Bottom 0.254: R8.1 76.2,56.8 57,56.8 56.4,57.4 47.4,57.4 v47,57 | v47,46.4 63.8,46.4 v64.2,46.8
N$77  (via drill 0.61)
  Top 0.254: v73.6,72.2 73.6,66.2 R11.2
  Bottom 0.254: R11.2 73.8,66 74.6,66 75.8,64.8 79,64.8 79.8,65.6 80,65.6 80.4,66 81.2,66 R9.2 | 55.4,72.2 43.8,72.2 43.8,73.8 KEYB.6 | 55.4,72.2 55.4,69.8 KEY-INTERN.3 | 55.4,72.2 v73.6,72.2
N$78  (via drill 0.61)
  Top 0.254: v46,56 46.4,55.6 46.4,47.4 46,47 v46,44 | v65.2,44.8 64.8,44.4 64.8,29.4 66.8,27.4 66.8,26.2 ESP-32-TERMINAL.8
  Bottom 0.254: v46,56 47.4,56 48.2,56.8 56.2,56.8 56.8,56.2 75.4,56.2 75.8,55.8 81.2,55.8 81.2,58.4 R9.1 | v46,44 48.2,44 49.4,45.2 64.8,45.2 v65.2,44.8
N$79
  Bottom 0.254: Q1.2 42,33.6 42,35 37,35 P8X32A.30
N$82  (via drill 0.61)
  Top 0.254: v97.6,45.6 v97.6,55.8 | v86.2,45.6 86.2,44.2 86.6,43.8 86.6,28.4 v86.2,28
  Bottom 0.254: v97.6,55.8 97.2,55.4 86.8,55.4 86.4,55.8 86.4,58.4 R14.1 | v97.6,45.6 97.2,45.2 88,45.2 87.6,45.6 v86.2,45.6 | v86.2,28 74.4,28 74.4,26.2 ESP-32-TERMINAL.11
N$83  (via drill 0.61)
  Top 0.254: v98.6,56.8 98.6,55.4 98.2,55 98.2,46.4 98.6,46 v98.6,43.8 | v88.2,43.6 87.8,43.2 87.8,29.4 v88.2,29
  Bottom 0.254: v98.6,56.8 89,56.8 89,58.4 R15.1 | v98.6,43.8 98.2,43.8 98,44 88.6,44 v88.2,43.6 | v88.2,29 85.8,29 85.4,28.6 75.2,28.6 74.8,29 71.8,29 71.8,26.2 ESP-32-TERMINAL.10
N$93
  Bottom 0.254: Q1.1 42,38.6 40,38.6 38.8,37.4 37,37.4 P8X32A.31
P0  (via drill 0.61)
  Top 0.254: v33.6,60.4 34.8,61.6 v35.2,61.6 | v100.8,66.2 v100.8,62.4
  Bottom 0.254: v33.6,60.4 21.6,60.4 P8X32A.1 | v35.2,61.6 35.6,62 48,62 48.2,61.8 56.8,61.8 57.6,62.6 63.8,62.6 64,62.4 65.6,62.4 66.4,61.6 72.8,61.6 73,61.8 74.2,61.8 74.4,61.6 83,61.6 83.2,61.8 84.4,61.8 84.6,61.6 87.8,61.6 88.6,62.4 v100.8,62.4 | v100.8,66.2 107.8,66.2 SV2.1
P1  (via drill 0.61)
  Top 0.254: v56.6,63 v56.6,59.8
  Bottom 0.254: v56.6,59.8 56.2,59.4 39.6,59.4 39.4,59.6 38.6,59.6 38.2,59.2 33.4,59.2 32.8,59.8 25.4,59.8 23.4,57.8 21.6,57.8 P8X32A.2 | v56.6,63 57.2,63 57.4,63.2 64,63.2 64.2,63 65.8,63 66.6,62.2 72.6,62.2 72.8,62.4 74.4,62.4 74.6,62.2 82.8,62.2 83,62.4 84.6,62.4 84.8,62.2 87.6,62.2 88.4,63 100,63 100.6,63.6 107.8,63.6 SV2.3
P2  (via drill 0.61)
  Top 0.254: v105.2,53.2 104.8,53.6 104.8,60.6 v105.2,61
  Bottom 0.254: v105.2,53.2 104.8,52.8 95.6,52.8 95.2,53.2 93,53.2 92.6,52.8 80.8,52.8 79,54.6 75.4,54.6 75,55 52.4,55 51.6,54.2 34.2,54.2 33.8,54.6 24.6,54.6 24.2,54.2 23.4,54.2 22.4,55.2 21.6,55.2 P8X32A.3 | v105.2,61 107.8,61 SV2.5
P3  (via drill 0.61)
  Top 0.254: v93.4,52.2 96,54.8 96,59 v95.6,59.4
  Bottom 0.254: v93.4,52.2 80.6,52.2 78.8,54 75.2,54 74.8,54.4 52.6,54.4 51.8,53.6 46.8,53.6 44.8,51.6 35.8,51.6 35.2,52.2 23.4,52.2 22.8,52.8 21.6,52.8 P8X32A.4 | v95.6,59.4 96.4,58.6 107.8,58.6 SV2.7
P4  (via drill 0.61)
  Top 0.254: v102,56 v102,50.6
  Bottom 0.254: v102,50.6 101.6,51 95.8,51 95.4,50.6 93,50.6 92.6,50.2 91.8,50.2 90.4,51.6 80.4,51.6 78.6,53.4 75,53.4 74.6,53.8 52.8,53.8 52,53 47,53 45,51 39.8,51 37.8,49 35.8,49 35.2,49.6 29.4,49.6 29,49.2 28.2,49.2 27.2,50.2 21.6,50.2 P8X32A.5 | v102,56 107.8,56 SV2.9
P5  (via drill 0.61)
  Top 0.254: v32.6,65.8 v32.6,47.6 | v99.6,53.8 v99.6,64
  Bottom 0.254: v32.6,47.6 21.6,47.6 P8X32A.6 | v32.6,65.8 40,65.8 40.8,65 41.6,65 42,65.4 56,65.4 57.6,63.8 64.2,63.8 64.4,63.6 66,63.6 66.8,62.8 72.4,62.8 72.6,63 74.6,63 74.8,62.8 82.6,62.8 82.8,63 84.8,63 85,62.8 87.4,62.8 88.2,63.6 99.2,63.6 v99.6,64 | v99.6,53.8 100,54.2 105.8,54.2 106.6,53.4 107.8,53.4 SV2.11
P6  (via drill 0.61)
  Top 0.254: v41,50 v41,46.2 | v90,50.6 90.4,51 v90.4,61.4 | v101.2,57 v101.2,61 | v106.2,57 106.2,53.2 107.8,51.6 107.8,51 SV2.13
  Bottom 0.254: v41,46.2 35.8,46.2 34.6,45 21.6,45 P8X32A.7 | v41,50 41.4,50.4 45.2,50.4 47.2,52.4 52.2,52.4 53,53.2 74.4,53.2 74.8,52.8 78.4,52.8 80.2,51 89.6,51 v90,50.6 | v90.4,61.4 90.8,61.8 100,61.8 100.8,61 v101.2,61 | v106.2,57 v101.2,57
P7  (via drill 0.61)
  Top 0.254: v27.6,70.2 28,69.8 28,51 27.6,50.6 27.6,42.6 21.6,42.6 P8X32A.8 | v31.4,71 31.4,79.4 33,81 v33,83
  Bottom 0.254: v27.6,70.2 29.8,70.2 30.6,71 v31.4,71 | v33,83 33.8,83.8 117.2,83.8 118.8,82.2 118.8,50.2 118,49.4 111,49.4 110.8,49.6 110,49.6 109.4,49 109.2,49 108.6,48.4 108,48.4 SV2.15
P18  (via drill 0.61)
  Top 0.254: v39.2,36 39.2,17.2 37,17.2 P8X32A.23 | v100.6,33.2 v100.6,36.2
  Bottom 0.254: v39.2,36 53,36 53.6,35.4 54.4,35.4 54.8,35.8 57.2,35.8 57.6,36.2 93.4,36.2 93.8,36.6 100.2,36.6 v100.6,36.2 | v100.6,33.2 107.8,33.2 SV2.27
P19  (via drill 0.61)
  Top 0.254: v40.8,19.6 41.2,20 v41.2,32.2 | v95.4,35.2 v95.4,31.8
  Bottom 0.254: v40.8,19.6 37,19.6 P8X32A.24 | v41.2,32.2 41.4,32 43.2,32 43.4,32.2 51.6,32.2 51.8,32.4 59.8,32.4 60.6,33.2 75.2,33.2 76.6,31.8 77.4,31.8 78.2,32.6 93,32.6 93.4,32.2 95,32.2 v95.4,31.8 | v95.4,35.2 105.6,35.2 106,35.6 107.8,35.6 SV2.25
P20  (via drill 0.61)
  Top 0.254: v90.8,23.2 v90.8,20 | v103.8,23.2 104.2,23.6 104.2,29.8 103.8,30.2 103.8,34.2 106.2,34.2 106.2,35.8 107.8,37.4 107.8,38.2 SV2.23
  Bottom 0.254: v90.8,20 90.4,19.6 72.6,19.6 72.2,20 42.8,20 41.4,21.4 41,21.4 40.2,22.2 37,22.2 P8X32A.25 | v90.8,23.2 91.2,22.8 93,22.8 93.2,22.6 103.2,22.6 v103.8,23.2
P21  (via drill 0.61)
  Top 0.254: v69,18.2 v69,21 | v94,13.6 v94,18 | v113.4,13.8 113.4,15.4 113.2,15.6 113.2,25 113.4,25.2 113.4,41.8 111,41.8 110.8,42 110,42 108.8,40.8 108,40.8 SV2.21
  Bottom 0.254: v69,21 68.6,20.6 53.4,20.6 53,21 53,24 48.8,24 48.2,24.6 47.2,24.6 46.8,24.2 37.4,24.2 37,24.6 P8X32A.26 | v69,18.2 69.2,18 72.2,18 72.6,18.4 93.6,18.4 v94,18 | v94,13.6 94.4,14 111.6,14 111.8,13.8 v113.4,13.8
P22  (via drill 0.61)
  Top 0.254: v33.6,27.4 34,27.8 34,43.2 v33.6,43.6 | v55.6,40.2 v55.6,42.2 | v90.8,42.2 v90.8,39.6
  Bottom 0.254: v33.6,27.4 36.8,27.4 P8X32A.27 | v33.6,43.6 38,43.6 38.4,43.2 39,43.2 40.6,41.6 48.2,41.6 48.4,41.8 55.2,41.8 v55.6,42.2 | v55.6,40.2 55.8,40.4 57,40.4 57.4,40 63.8,40 64.6,39.2 90.4,39.2 v90.8,39.6 | v90.8,42.2 91.2,41.8 93,41.8 93.4,41.4 104,41.4 106,43.4 107.8,43.4 SV2.19
P23  (via drill 0.61)
  Top 0.254: v40.2,28.6 39.8,28.2 39.8,21.2 v40.2,20.8 | v70.4,21 v70.4,19 | v89.6,24.2 v89.6,20.6 | v99.6,45.8 v99.6,24.2
  Bottom 0.254: v40.2,28.6 39,29.8 37,29.8 P8X32A.28 | v40.2,20.8 41.2,20.8 42.6,19.4 70,19.4 v70.4,19 | v70.4,21 70.8,20.6 72.4,20.6 72.8,20.2 89.2,20.2 v89.6,20.6 | v99.6,24.2 v89.6,24.2 | v99.6,45.8 107.8,45.8 SV2.17
P27  (via drill 0.61)
  Top 0.254: v28.6,74.2 v28.6,50.2
  Bottom 0.254: v28.6,50.2 36.8,50.2 P8X32A.36 | v28.6,74.2 17,74.2 R23.2
P28  (via drill 0.61)
  Top 0.254: v41.2,66 40.8,65.6 40.8,57.8 40.6,57.6 40.6,53.2 v41,52.8 | v104.8,22.4 104.8,30.6 107.8,30.6 SV2.29 | v78,22.6 77.6,22.2 77.6,15.4 v78,15 | v44.6,52.8 44.6,47.2 44.2,46.8 44.2,29.6 45.2,28.6 45.2,14.6 v44.8,14.2
  Bottom 0.254: IC1.6 16.4,53.4 18.2,53.4 18.6,53.8 22.6,53.8 23.6,52.8 36.8,52.8 P8X32A.37 37,52.8 v41,52.8 v44.6,52.8 | v41.2,66 58.4,66 R20.2 | v104.8,22.4 104.4,22 93,22 92.8,22.2 78.4,22.2 v78,22.6 | v78,15 77.6,14.6 69.2,14.6 69,14.8 68.2,14.8 67.6,14.2 66.2,14.2 RTC.2 66,14.2 v44.8,14.2
P29  (via drill 0.61)
  Top 0.254: v23.8,51.2 v23.8,55.2 | R19.1 16,47.2 16,49 16.4,49.4 16.4,50.8 IC1.5 | v106,21.8 106,28 107.8,28 SV2.31 | v76,21.6 76.4,21.2 76.4,13 76,12.6 v76,11.2 | v34.6,23.6 v34.6,55.2 | v47.6,23.6 48,23.2 v48,13.2
  Bottom 0.254: v23.8,55.2 v34.6,55.2 36.8,55.2 P8X32A.38 | v23.8,51.2 18.6,51.2 18.2,50.8 IC1.5 | v106,21.8 105.6,21.4 92.8,21.4 92.6,21.6 v76,21.6 | v76,11.2 68.4,11.2 68,11.6 66.2,11.6 RTC.3 66,11.6 64.8,11.6 62.8,13.6 48.4,13.6 v48,13.2 | v47.6,23.6 v34.6,23.6
P30  (via drill 0.61)
  Top 0.254: v29.6,57.8 29.2,58.2 29.2,73.4 29.6,73.8 v29.6,77.4 | v98.6,25.6 99,26 99,33.6 v98.6,34 | v45.2,35 44.8,35.4 44.8,46.6 45.8,47.6 45.8,54.8 45,55.6 v45,57
  Bottom 0.254: v29.6,57.8 36.8,57.8 P8X32A.39 37,57.8 38,57.8 38.6,57.2 39.4,57.2 39.6,57.4 44.6,57.4 v45,57 | v29.6,77.4 29.2,77 13,77 12.6,77.4 12.6,81 PROP-PLUG.1 | v98.6,25.6 107.8,25.6 SV2.33 | v98.6,34 94,34 93.6,34.4 53.8,34.4 52.8,35.4 45.6,35.4 v45.2,35
P31  (via drill 0.61)
  Top 0.254: v19.4,61.6 19,62 v19,78.8 | v101.4,32.2 v101.4,24.2 | v51,33.8 50.6,34.2 50.6,39.2 50.8,39.4 50.8,42.8 51.2,43.2 51.2,46.6 v50.4,47.4 | v42,60.4 v42,48.6
  Bottom 0.254: v19.4,61.6 19.8,62 33.4,62 35,60.4 36.8,60.4 P8X32A.40 37,60.4 v42,60.4 | v19,78.8 15.2,78.8 15.2,81 PROP-PLUG.2 | v101.4,24.2 104.4,24.2 105.6,23 107.8,23 SV2.35 | v101.4,32.2 99,32.2 97.8,33.4 93.8,33.4 93.4,33.8 v51,33.8 | v50.4,47.4 50,47.4 49.8,47.2 47.6,47.2 46.2,48.6 v42,48.6
RESET  (via drill 0.61)
  Top 0.254: v13.8,35 13.8,37.4 C2.1 13.8,37.6 13.8,38.8 12.6,40 12.6,46.6 12.8,46.8 12.8,57.8 13,58 v13,60 | v43.8,26.2 43.8,22 R24.1 | v23.8,26.2 23.8,35 21.6,35 P8X32A.11 | v18.4,60 18.4,78 17.6,78.8 17.6,81 PROP-PLUG.3
  Bottom 0.254: P8X32A.11 21.4,35 16.2,35 R13.2 16,35 v13.8,35 | v23.8,26.2 v43.8,26.2 | GLOB_RESET.1 4.2,37.4 13.6,37.4 C2.1 | v13,60 v18.4,60
RXD0  (via drill 0.61)
  Top 0.254: v105.2,41.2 v105.2,37.2 | v59.2,42.2 59.2,48.6 ESP-32-TERMINAL.34
  Bottom 0.254: v105.2,37.2 107.2,37.2 107.4,37 108.2,37 109.6,35.6 110.2,35.6 SV2.26 | v105.2,41.2 104.8,40.8 93.2,40.8 92.8,41.2 90.4,41.2 89.4,42.2 79,42.2 78.6,41.8 59.6,41.8 v59.2,42.2
TXD0  (via drill 0.61)
  Top 0.254: v106.4,38.8 106.8,38.8 107.4,39.4 108.2,39.4 109.2,38.4 110.2,38.4 SV2.24 | v56.6,39.4 56.6,48.6 ESP-32-TERMINAL.35
  Bottom 0.254: v106.4,38.8 106,38.8 105.8,39 93,39 92.6,38.6 64.4,38.6 63.6,39.4 v56.6,39.4
VCC  (via drill 0.61)
  Top 0.635: 5V.1 80.8,4.2 80.8,6 80.4,6.4 80.4,9.2 C6.1 80.4,9.4 80.4,14.2 v79.6,15 79.6,16.6 C8.+ | v112.2,15 v112.2,25.6 | v59.4,76.4 59.4,72.2 60.6,71 60.6,69.8 KEY-INTERN.1 | v70,70.4 v70,76.4 | v48.6,63 48.6,74.4 50.4,76.2 KEYB.5
  Bottom 0.635: v112.2,25.6 110.4,25.6 SV2.34 | v79.6,15 v112.2,15 | v59.4,76.4 50.6,76.4 KEYB.5 | v70,76.4 68.2,76.4 MOUSE.5 | v70,70.4 69.8,70.6 64.8,70.6 64,69.8 60.6,69.8 KEY-INTERN.1 | 18.6,1.4 18.6,3.6 SD-CARD2.3 | 18.6,1.4 60.6,1.4 60.8,1.6 | 60.8,1.6 61.2,2 61.2,3.8 61.6,3.8 SD-CARD.3 | 7.2,65.2 2,65.2 1.4,64.6 1.4,2.6 2.6,1.4 18.6,1.4 | v48.6,63 7.2,63 7.2,65.2 | 7.2,65.2 AUDIO-INTERN.1 | 5V.1 80.6,4.2 78.8,4.2 78.8,2 78.2,1.4 61,1.4 60.8,1.6
VDD  (via drill 0.61)
  Top 0.635: v15.8,10.4 15.8,3.8 SD-CARD2.2 | C1.1 11.6,32.2 v11.6,47.2 11.8,47.4 v11.8,58.4 | v16.2,32.2 16.2,27.6 R13.1 16.2,27.2 16.2,26.2 15,25 15,23.8 ESP-PSRAM64.8 14.8,23.8 12.6,23.8 v12.6,10.6 | 3,3V.1 93.4,4.4 93.4,6.2 93,6.6 93,9.2 C7.1 93,9.4 93,11.2 92.2,12 92.2,13.6 | 92.2,13.6 92.2,16.6 C9.+ 92.2,17 v92.2,20.4 | v59.2,16.8 59.2,4 SD-CARD.2 | v39,40 v39,58.4 | v49,40 49,26.2 ESP-32-TERMINAL.1 49,25.8 49,17.8 v49.2,17.6 | v68.6,16.8 v68.6,13.6 | v92,13.6 92.2,13.6 | v31.8,32.4 31.8,40.6 C5.1
  Bottom 0.635: R1.2 3.4,16 3.4,12.6 7.2,12.6 R22.2 7.4,12.4 7.4,10.4 12.6,10.4 | 12.6,10.4 v15.8,10.4 | 16.2,32.4 13.6,32.4 13.4,32.2 11.6,32.2 C1.1 | 16.2,32.4 21.4,32.4 P8X32A.12 21.8,32.4 v31.8,32.4 | v11.6,47.2 8.4,47.2 R19.2 | v11.8,58.4 16.2,58.4 IC1.8 | v16.2,32.2 16.2,32.4 | v12.6,10.6 12.6,10.4 | SV2.38 110.2,20.4 108,20.4 SV2.37 107.6,20.4 v92.2,20.4 | R17.1 94.2,58.4 91.8,58.4 R16.1 91.6,58.6 91.6,60 83.8,60 | 73.6,60 73.6,58.6 R11.1 | 83.8,60 73.6,60 | 83.8,60 83.8,58.6 R10.1 | C5.1 31.8,40.6 33.6,40.6 34.2,40 36.8,40 P8X32A.32 37,40 v39,40 v49,40 | v39,58.4 58.4,58.4 R20.1 58.4,58.6 58.4,60.2 64.8,60.2 65,60 73.6,60 | v49.2,17.6 49.4,17.8 58.2,17.8 v59.2,16.8 66,16.8 RTC.1 66.2,16.8 v68.6,16.8 | v92,13.6 91.8,13.8 80,13.8 79.8,13.6 v68.6,13.6
VSS
  Bottom 0.406: X2.VSS1 77.6,73.66 77.6,76.83 | X2.VSS 99.95,73.66 102.62,76.96
  pour Top: 1.27,83.82 119,83.82 119,1.27 1.27,1.27
  pour Bottom: 1.27,83.82 119,83.82 119,1.27 1.27,1.27

### Text on the board
tPlace: RTC
tNames: ESPRO-RC | 04/2021 | Version2 | R.Zielinski | 3,3V | 5V | + - | + -